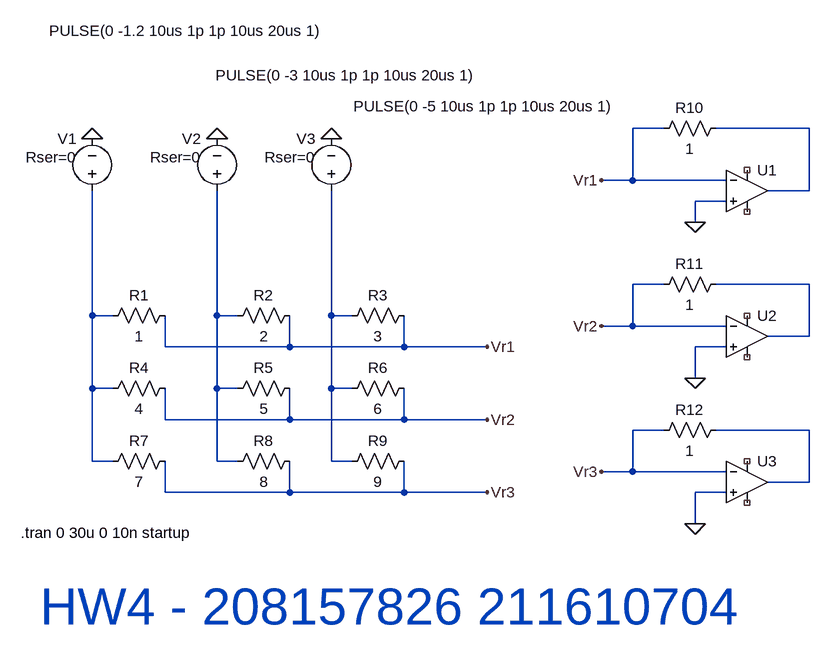
[diagram p0: schematic Q1_part_b.asc]
Q1_part_b.asc, the LTspice schematic file:
Version 4
SHEET 1 1608 680
WIRE 1008 -160 960 -160
WIRE 1232 -160 1088 -160
WIRE 960 -80 960 -160
WIRE 960 -80 912 -80
WIRE 1104 -80 960 -80
WIRE 1232 -64 1232 -160
WIRE 1232 -64 1168 -64
WIRE 1104 -48 1056 -48
WIRE 1056 -16 1056 -48
WIRE 1008 80 960 80
WIRE 1232 80 1088 80
WIRE 128 128 128 -64
WIRE 160 128 128 128
WIRE 320 128 320 -64
WIRE 352 128 320 128
WIRE 496 128 496 -64
WIRE 528 128 496 128
WIRE 960 144 960 80
WIRE 960 144 912 144
WIRE 1104 144 960 144
WIRE 1232 160 1232 80
WIRE 1232 160 1168 160
WIRE 240 176 240 128
WIRE 432 176 432 128
WIRE 432 176 240 176
WIRE 608 176 608 128
WIRE 608 176 432 176
WIRE 736 176 608 176
WIRE 1104 176 1056 176
WIRE 1056 224 1056 176
WIRE 128 240 128 128
WIRE 160 240 128 240
WIRE 320 240 320 128
WIRE 352 240 320 240
WIRE 496 240 496 128
WIRE 528 240 496 240
WIRE 240 288 240 240
WIRE 432 288 432 240
WIRE 432 288 240 288
WIRE 608 288 608 240
WIRE 608 288 432 288
WIRE 736 288 608 288
WIRE 1008 304 960 304
WIRE 1232 304 1088 304
WIRE 128 352 128 240
WIRE 160 352 128 352
WIRE 320 352 320 240
WIRE 352 352 320 352
WIRE 496 352 496 240
WIRE 528 352 496 352
WIRE 960 368 960 304
WIRE 960 368 912 368
WIRE 1104 368 960 368
WIRE 1232 384 1232 304
WIRE 1232 384 1168 384
WIRE 240 400 240 352
WIRE 432 400 432 352
WIRE 432 400 240 400
WIRE 608 400 608 352
WIRE 608 400 432 400
WIRE 736 400 608 400
WIRE 1104 400 1056 400
WIRE 1056 448 1056 400
FLAG 128 -144 0
FLAG 320 -144 0
FLAG 496 -144 0
FLAG 736 176 Vr1
FLAG 736 288 Vr2
FLAG 736 400 Vr3
FLAG 1056 -16 0
FLAG 1056 224 0
FLAG 1056 448 0
FLAG 912 -80 Vr1
FLAG 912 144 Vr2
FLAG 912 368 Vr3
SYMBOL res 256 112 R90
WINDOW 0 0 56 VBottom 2
WINDOW 3 32 56 VTop 2
SYMATTR InstName R1
SYMATTR Value 1
SYMBOL res 448 112 R90
WINDOW 0 0 56 VBottom 2
WINDOW 3 32 56 VTop 2
SYMATTR InstName R2
SYMATTR Value 2
SYMBOL res 624 112 R90
WINDOW 0 0 56 VBottom 2
WINDOW 3 32 56 VTop 2
SYMATTR InstName R3
SYMATTR Value 3
SYMBOL res 256 224 R90
WINDOW 0 0 56 VBottom 2
WINDOW 3 32 56 VTop 2
SYMATTR InstName R4
SYMATTR Value 4
SYMBOL res 448 224 R90
WINDOW 0 0 56 VBottom 2
WINDOW 3 32 56 VTop 2
SYMATTR InstName R5
SYMATTR Value 5
SYMBOL res 624 224 R90
WINDOW 0 0 56 VBottom 2
WINDOW 3 32 56 VTop 2
SYMATTR InstName R6
SYMATTR Value 6
SYMBOL res 256 336 R90
WINDOW 0 0 56 VBottom 2
WINDOW 3 32 56 VTop 2
SYMATTR InstName R7
SYMATTR Value 7
SYMBOL res 448 336 R90
WINDOW 0 0 56 VBottom 2
WINDOW 3 32 56 VTop 2
SYMATTR InstName R8
SYMATTR Value 8
SYMBOL res 624 336 R90
WINDOW 0 0 56 VBottom 2
WINDOW 3 32 56 VTop 2
SYMATTR InstName R9
SYMATTR Value 9
SYMBOL voltage 128 -48 R180
WINDOW 0 24 96 Left 2
WINDOW 3 -356 262 Left 2
WINDOW 123 0 0 Left 0
WINDOW 39 24 68 Left 2
SYMATTR InstName V1
SYMATTR Value PULSE(0 -1.2 10us 1p 1p 10us 20us 1)
SYMATTR SpiceLine Rser=0
SYMBOL voltage 320 -48 R180
WINDOW 0 24 96 Left 2
WINDOW 3 -400 194 Left 2
WINDOW 123 0 0 Left 0
WINDOW 39 24 68 Left 2
SYMATTR InstName V2
SYMATTR Value PULSE(0 -3 10us 1p 1p 10us 20us 1)
SYMATTR SpiceLine Rser=0
SYMBOL voltage 496 -48 R180
WINDOW 0 24 96 Left 2
WINDOW 3 -436 146 Left 2
WINDOW 123 0 0 Left 0
WINDOW 39 24 68 Left 2
SYMATTR InstName V3
SYMATTR Value PULSE(0 -5 10us 1p 1p 10us 20us 1)
SYMATTR SpiceLine Rser=0
SYMBOL OpAmps\\UniversalOpAmp 1136 -64 R0
SYMATTR InstName U1
SYMATTR Value2 Avol=10Meg GBW=1000Meg Vos=0
SYMBOL OpAmps\\UniversalOpAmp 1136 160 R0
SYMATTR InstName U2
SYMATTR Value2 Avol=10Meg GBW=1000Meg Vos=0
SYMBOL OpAmps\\UniversalOpAmp 1136 384 R0
SYMATTR InstName U3
SYMATTR Value2 Avol=10Meg GBW=1000Meg Vos=0
SYMBOL res 1104 -176 R90
WINDOW 0 0 56 VBottom 2
WINDOW 3 32 56 VTop 2
SYMATTR InstName R10
SYMATTR Value 1
SYMBOL res 1104 64 R90
WINDOW 0 0 56 VBottom 2
WINDOW 3 32 56 VTop 2
SYMATTR InstName R11
SYMATTR Value 1
SYMBOL res 1104 288 R90
WINDOW 0 0 56 VBottom 2
WINDOW 3 32 56 VTop 2
SYMATTR InstName R12
SYMATTR Value 1
TEXT 18 462 Left 2 !.tran 0 30u 0 10n startup
TEXT 48 576 Left 6 ;HW4 - 208157826 211610704

The netlist it stands for:
* Q1_part_b.asc
R1 Vr1 N003 1
R2 Vr1 N004 2
R3 Vr1 N005 3
R4 Vr2 N003 4
R5 Vr2 N004 5
R6 Vr2 N005 6
R7 Vr3 N003 7
R8 Vr3 N004 8
R9 Vr3 N005 9
V1 N003 0 PULSE(0 -1.2 10us 1p 1p 10us 20us 1) Rser=0
V2 N004 0 PULSE(0 -3 10us 1p 1p 10us 20us 1) Rser=0
V3 N005 0 PULSE(0 -5 10us 1p 1p 10us 20us 1) Rser=0
XU1 0 Vr1 NC_01 NC_02 N001 level1 Avol=10Meg GBW=1000Meg Vos=0 En=0 Enk=0 In=0 Ink=0 Rin=500Meg  ; pins In+ In- V+ V- OUT
XU2 0 Vr2 NC_03 NC_04 N002 level1 Avol=10Meg GBW=1000Meg Vos=0 En=0 Enk=0 In=0 Ink=0 Rin=500Meg  ; pins In+ In- V+ V- OUT
XU3 0 Vr3 NC_05 NC_06 N006 level1 Avol=10Meg GBW=1000Meg Vos=0 En=0 Enk=0 In=0 Ink=0 Rin=500Meg  ; pins In+ In- V+ V- OUT
R10 N001 Vr1 1
R11 N002 Vr2 1
R12 N006 Vr3 1
.tran 0 30u 0 10n startup
* HW4 - 208157826 211610704
.lib UniversalOpAmp1.lib
.backanno
.end